# EAGLE design TinyTony_ShenzenReady (EAGLE 8.5.0)
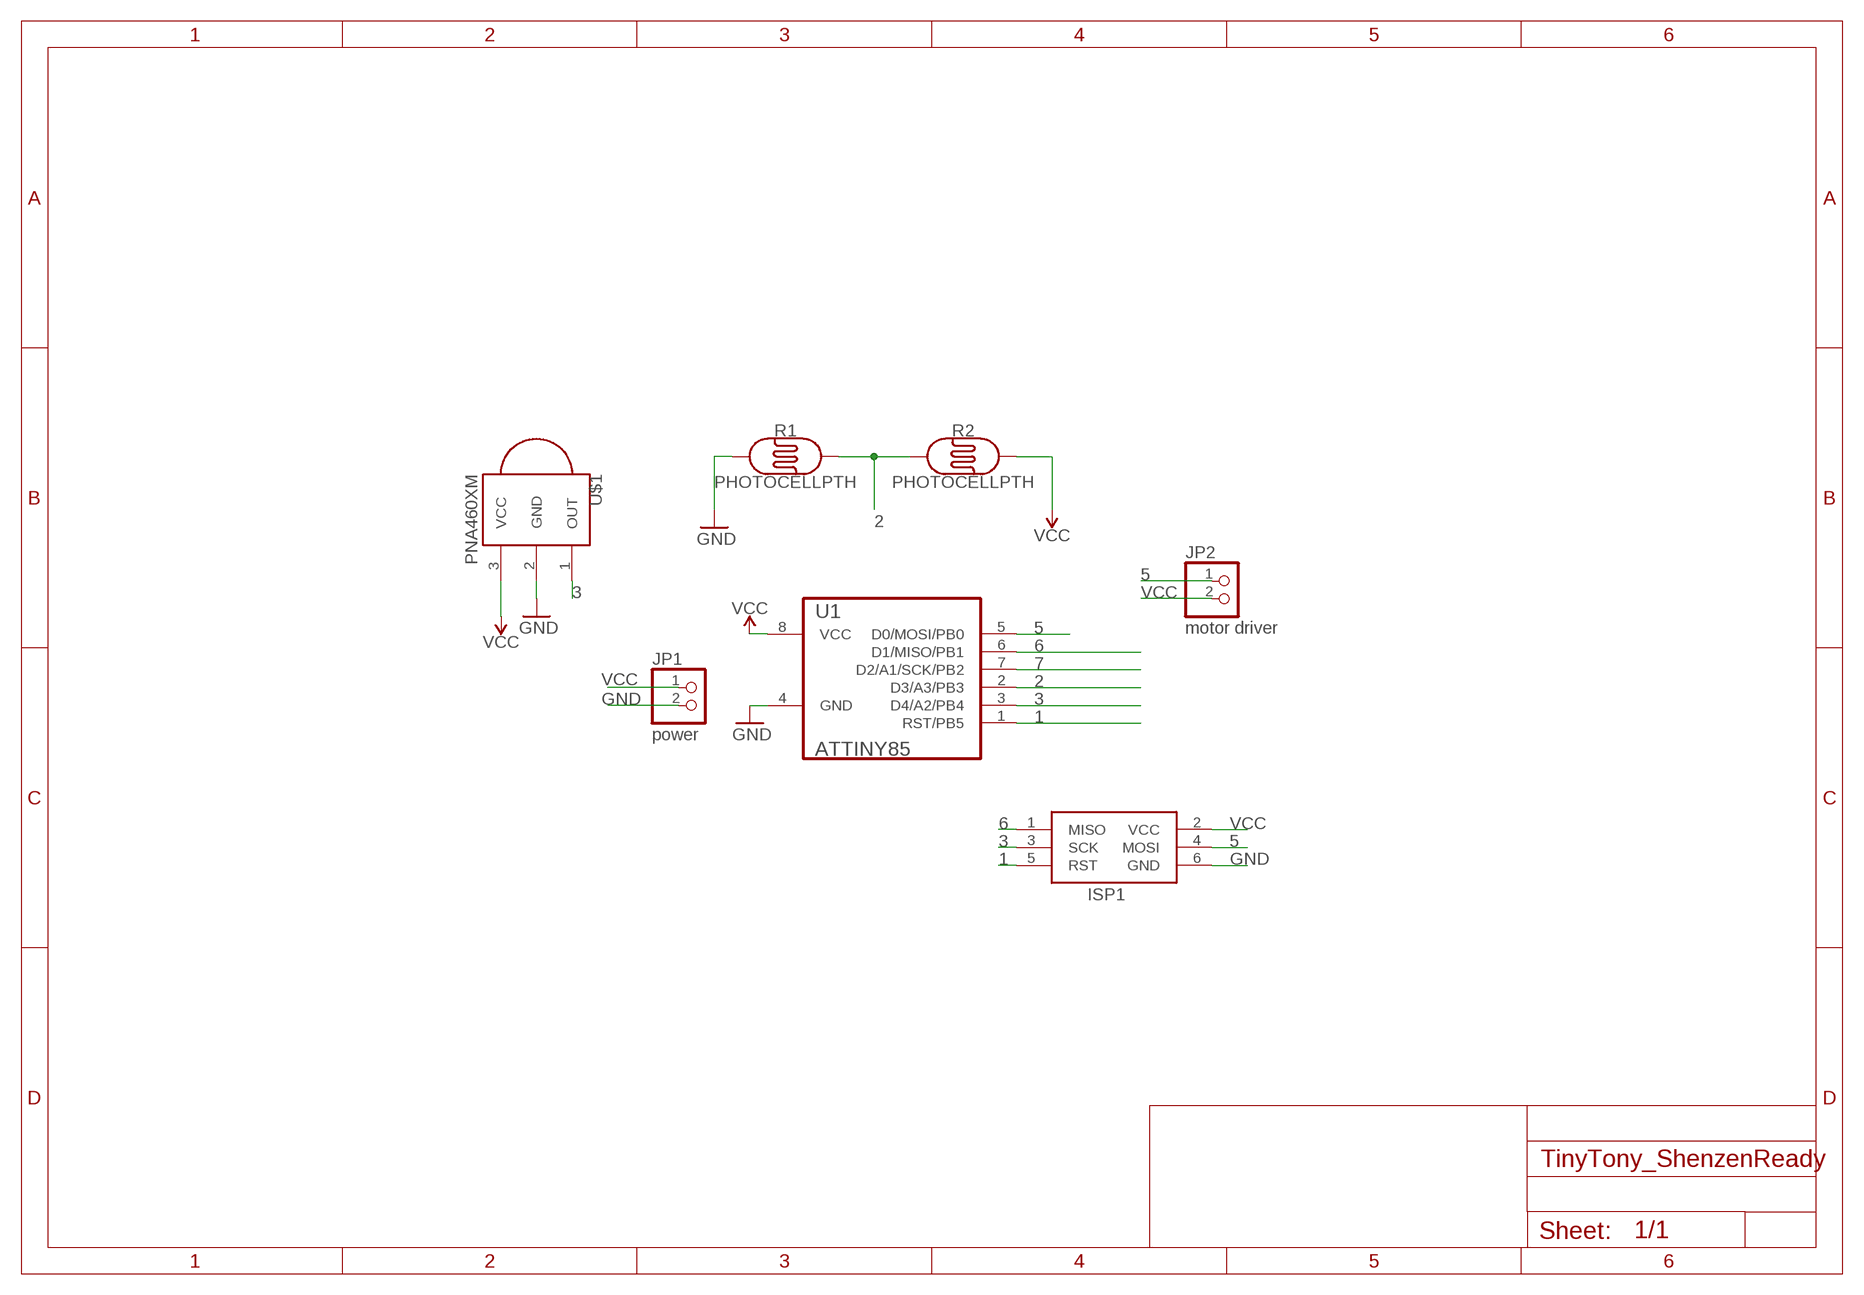
[diagram p0: schematic, sheet 1]

## Parts
ISP1  AVRISPPOGO  [AVRISP-50MIL]
JP1  power  HEADER-1X2ROUND  [1X02_ROUND]
JP2  motor driver  HEADER-1X2ROUND  [1X02_ROUND]
R1  PHOTOCELLPTH  [PHOTOCELL]
R2  PHOTOCELLPTH  [PHOTOCELL]
U1  ATTINY85  ATTINY85-20SU  [SOIC127P798X216-8N]
U$1  PNA460XM  [PNA460XM]

## Nets
1: ISP1.5(RST) U1.1(RST/PB5)
2: R1.2 R2.1 U1.2(D3/A3/PB3)
3: ISP1.3(SCK) U1.3(D4/A2/PB4) U$1.1(OUT)
5: ISP1.4(MOSI) JP2.1 U1.5(D0/MOSI/PB0)
6: ISP1.1(MISO) U1.6(D1/MISO/PB1)
7: U1.7(D2/A1/SCK/PB2)
GND: ISP1.6(GND) JP1.2 R1.1 U1.4(GND) U$1.2(GND)
VCC: ISP1.2(VCC) JP1.1 JP2.2 R2.2 U1.8(VCC) U$1.3(VCC)

## Library data of the parts
ISP1 = tinytony_shenzenReady:AVRISP: AVR ISP HEADER Standard 6 pin header for AVR programming
JP1 JP2 = tinytony_shenzenReady:HEADER-1X2: PIN HEADER
R1 R2 = SparkFun-Sensors:PHOTOCELL: Photocell (Photodetector, Photo Resistor, CdS) This is a very small light sensor. A photocell changes (also called a photodetector, photo resistor, CdS or photoconductive cell) resistance depending on the amount of light it is exposed to. These little sensors make great ambient light triggers (when light in the room turns on, do something). Datasheet <http://cdn.sparkfun.com/datasheets/Sensors/LightImaging/SEN-09088.pdf> SparkFun Products Mini Photocell <https://www.sparkfun.com/products/9088> (SEN-09088); PROD_ID: COMP-09129; SF_ID: SEN-09088
U1 = tinytony_shenzenReady:ATTINY85-20SU: 8-bit Microcontroller with In-System Programmable Flash; MPN: ATTINY85-20SU; OC_FARNELL: 1455164; OC_NEWARK: 58M3797; PACKAGE: SOIC-8; SUPPLIER: Atmel
U$1 = adafruit:PNA460XM: IR 38KHz receiver PNA4602 and related receivers http://www.ladyada.net/library/pcb/eaglelibrary.html

## Board
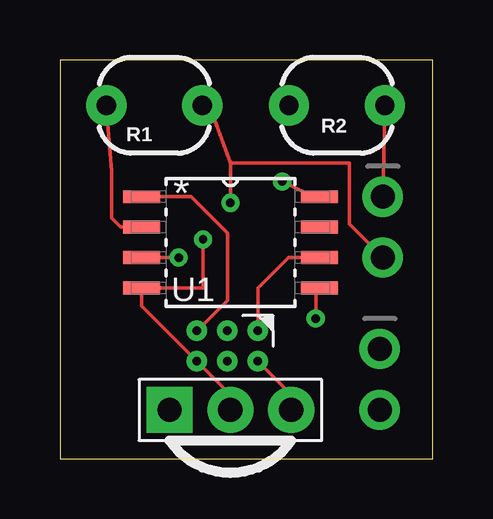
[diagram p1: board, top side]
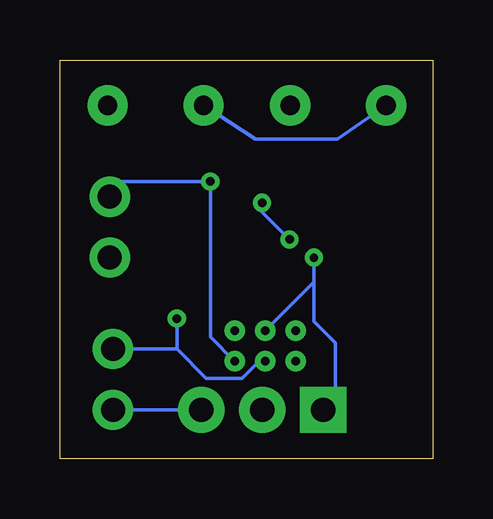
[diagram p2: board, bottom side, seen from below]

Size 15.54 x 16.63 mm. Coordinates in mm from the lower left corner, seen from the top.
Outline: 0,0 15.54,0 15.54,16.63 0,16.63 0,0
Copper layers (1*16): Top 0.035mm / dielectric 1.5mm / Bottom 0.035mm
Design rules "PCBway": minimum track width 6mil, minimum drill 0.3mm, track to track 0.205mm, track to pad 0.205mm, pad to pad 0.205mm, via to via 0.205mm, smd to smd 8mil, copper to edge 40mil, drill to drill 8mil, minimum pad ring 10mil, minimum via ring 8mil, stop-mask expansion 4mil, vias tented up to drill 25mil, thermal gap 10mil

### Footprints (pad centres in the part's own frame; a part is rotated, then mirrored left to right if it is on the bottom)
AVRISP-50MIL = drill 0.35 pad 0.8: 1 -1.27,2.54; 2 0,2.54; 3 -1.27,1.27; 4 0,1.27; 5 -1.27,0; 6 0,0
1X02_ROUND = drill 1 pad 1.676: 1 -1.27,0; 2 1.27,0
PHOTOCELL = drill 0.8 pad 1.676: 1 -2,0; 2 2,0
SOIC127P798X216-8N = smd 1.549 x 0.533: 1 -3.708,1.905; 2 -3.708,0.635; 3 -3.708,-0.635; 4 -3.708,-1.905; 5 3.708,-1.905; 6 3.708,-0.635; 7 3.708,0.635; 8 3.708,1.905
PNA460XM = drill 1.016 pad 1.93 square: 1 -2.54,0 | drill 1.016 pad 1.93: 2 0,0; 3 2.54,0

### Placement (x,y rotation side)
ISP1  5.71,4.06 270 top
JP1  13.46,9.65 270 top
JP2  13.34,3.3 270 top
R1  3.94,14.73 180 top
R2  11.56,14.73 0 top
U1  7.11,9.02 0 top
U$1  7.11,2.03 0 top

### Tracks (layer width: path | path; a pad name or v marks a point on that pad's centre or on a via)
1
  Top 0.152: ISP1.5 6.99,6.6 6.99,9.4 5.46,10.92 U1.1
2
  Top 0.152: R1.2 2.17,11.97 2.16,11.68 2.16,10.03 2.54,9.65 U1.2
  Bottom 0.152: R2.1 7.4,13.34 3.97,13.34 R1.2
3  (via drill 0.35)
  Top 0.152: v4.95,8.38 U1.3
  Bottom 0.152: ISP1.3 4.95,7.37 v4.95,8.38 4.95,5.71 4.06,4.83 4.06,2.54 U$1.1
5  (via drill 0.35)
  Top 0.152: v10.67,5.84 10.67,6.96 U1.5
  Bottom 0.152: ISP1.4 7.25,4.06 7.96,3.35 9.45,3.35 10.67,4.57 | 10.67,4.57 v10.67,5.84 | 10.67,4.57 JP2.1
6
  Top 0.152: ISP1.1 8.26,7.11 9.53,8.38 U1.6
GND  (via drill 0.35)
  Top 0.152: U$1.2 7.11,2.67 ISP1.6 3.4,6.38 U1.4 5.97,7.11 v5.97,9.14 | JP1.2 12.06,9.78 12.06,12.32 7.11,12.32 | 7.11,12.32 6.45,14.13 R1.1 | v7.11,10.67 7.11,12.32
  Bottom 0.152: v5.97,9.14 7.11,10.29 v7.11,10.67
VCC  (via drill 0.35)
  Top 0.152: v9.27,11.56 10.57,10.92 U1.8 | ISP1.2 9.65,2.67 U$1.3 | R2.2 13.56,14.64 JP1.1
  Bottom 0.152: ISP1.2 9.27,5.08 v9.27,11.56 13.46,11.56 JP1.1 | JP2.2 U$1.3